# Altium schematic sheet uC_input.SchDoc
size A; SheetNumber: 10; SheetTotal: 12; SPICEModelCacheXWDQNBJN: <root> / <DocumentId>XWDQNBJN</DocumentId> / <CacheFrame Number="0"> / <Model Name="led0" Kind="MDL"> / <Text>*Typ INFRARED GaAs LED: Vf=1.2V Vr=5V If=40mA trr=3uS / *LED Pinout: 1=A, 2=K / .MODEL LED0 D (IS=93.5P RS=84M N=2.63 BV=5 IBV=10U / + CJO=2.97P VJ=.75 M=.333 TT=4.32U)</Text> / </Model> / </CacheFrame> / </root>
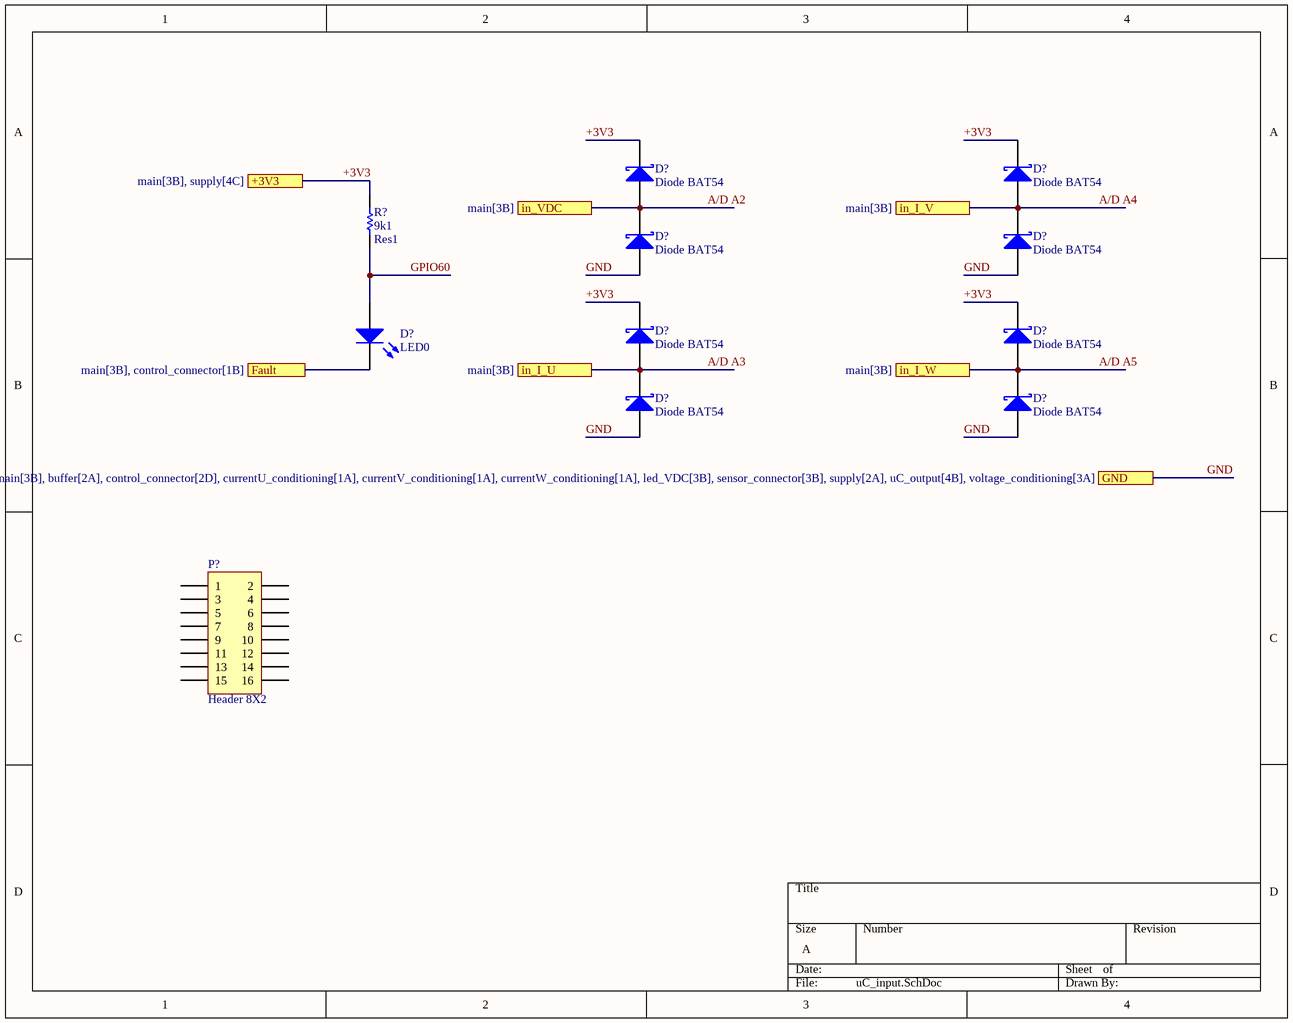
[diagram p0: uC_input.SchDoc]

## Parts
(Parts that share a designator on the sheet are numbered #1, #2 ... from top to bottom, then left to right.)
D?#1  Diode BAT54  [DO-204AL]
D?#2  Diode BAT54  [DO-204AL]
D?#3  Diode BAT54  [DO-204AL]
D?#4  Diode BAT54  [DO-204AL]
D?#5  LED0  [LED-0]
D?#6  Diode BAT54  [DO-204AL]
D?#7  Diode BAT54  [DO-204AL]
D?#8  Diode BAT54  [DO-204AL]
D?#9  Diode BAT54  [DO-204AL]
P?  Header 8X2  [HDR2X8]
R?  Res1  value 9k1  [AXIAL-0.3]

## Ports
+3V3 (see main[3B], supply[4C]), Fault (see main[3B], control_connector[1B]), GND (see main[3B], buffer[2A], control_connector[2D], currentU_conditioning[1A], currentV_conditioning[1A], currentW_conditioning[1A], led_VDC[3B], sensor_connector[3B], supply[2A], uC_output[4B], voltage_conditioning[3A]), in_I_U (see main[3B]), in_I_V (see main[3B]), in_I_W (see main[3B]), in_VDC (see main[3B])

## Nets
+3V3: D?#1.2(K) D?#2.2(K) D?#6.2(K) D?#7.2(K) R?.2 ; port +3V3
A/D A2: D?#1.1(A) D?#3.2(K) ; port in_VDC
A/D A3: D?#6.1(A) D?#8.2(K) ; port in_I_U
A/D A4: D?#2.1(A) D?#4.2(K) ; port in_I_V
A/D A5: D?#7.1(A) D?#9.2(K) ; port in_I_W
Fault: D?#5.2(K) ; port Fault
GND: D?#3.1(A) D?#4.1(A) D?#8.1(A) D?#9.1(A) ; port GND
GPIO60: D?#5.1(A) R?.1

Not connected (* = marked no-connect by the designer): P? 1 2 3 4 5 6 7 8 9 10 11 12 13 14 15 16

## Library data of the parts
D?#1-D?#4 D?#6-D?#9 = Diode 11DQ03: Schottky Rectifier; Published: 8-Jun-2000; LatestRevisionDate: 17-Jul-2002; LatestRevisionNote: Re-released for DXP Platform.; DatasheetVersion: Dec-1997; PackageReference: DO-204AL; Publisher: Altium Limited; PackageDescription: Diode, Axial; Body 5.2 x 2.7 mm (LxDia. max), Lead Dia. 0.86 mm (max); Code_JEDEC: DO-204-AL; ComponentLink1Description: Manufacturer Link; ComponentLink1URL: http://www.irf.com/; ComponentLink2Description: Datasheet; ComponentLink2URL: http://www.irf.com/product-info/datasheets/data/11dq03.pdf
D?#5 = LED0: Typical INFRARED GaAs LED; Published: 8-Jun-2000; LatestRevisionDate: 08-Jul-2005; LatestRevisionNote: Mech Layer 1 removed.; PackageReference: LED-0; Publisher: Altium Limited; PackageDescription: LED; 2 Leads
P? = Header 8X2: Header, 8-Pin, Dual row; LatestRevisionDate: 17-Jul-2002; LatestRevisionNote: Re-released for DXP Platform.; Publisher: Altium Limited
R? = Res1: Resistor; Published: 8-Jun-2000; LatestRevisionDate: 17-Jul-2002; LatestRevisionNote: Re-released for DXP Platform.; PackageReference: AXIAL-0.3; Publisher: Altium Limited; PackageDescription: Axial Device, Thru-Hole; 2 Leads; 0.3 in Pin Spacing